# EAGLE design IndoorStation_PCB_M3 (EAGLE 9.7.0)
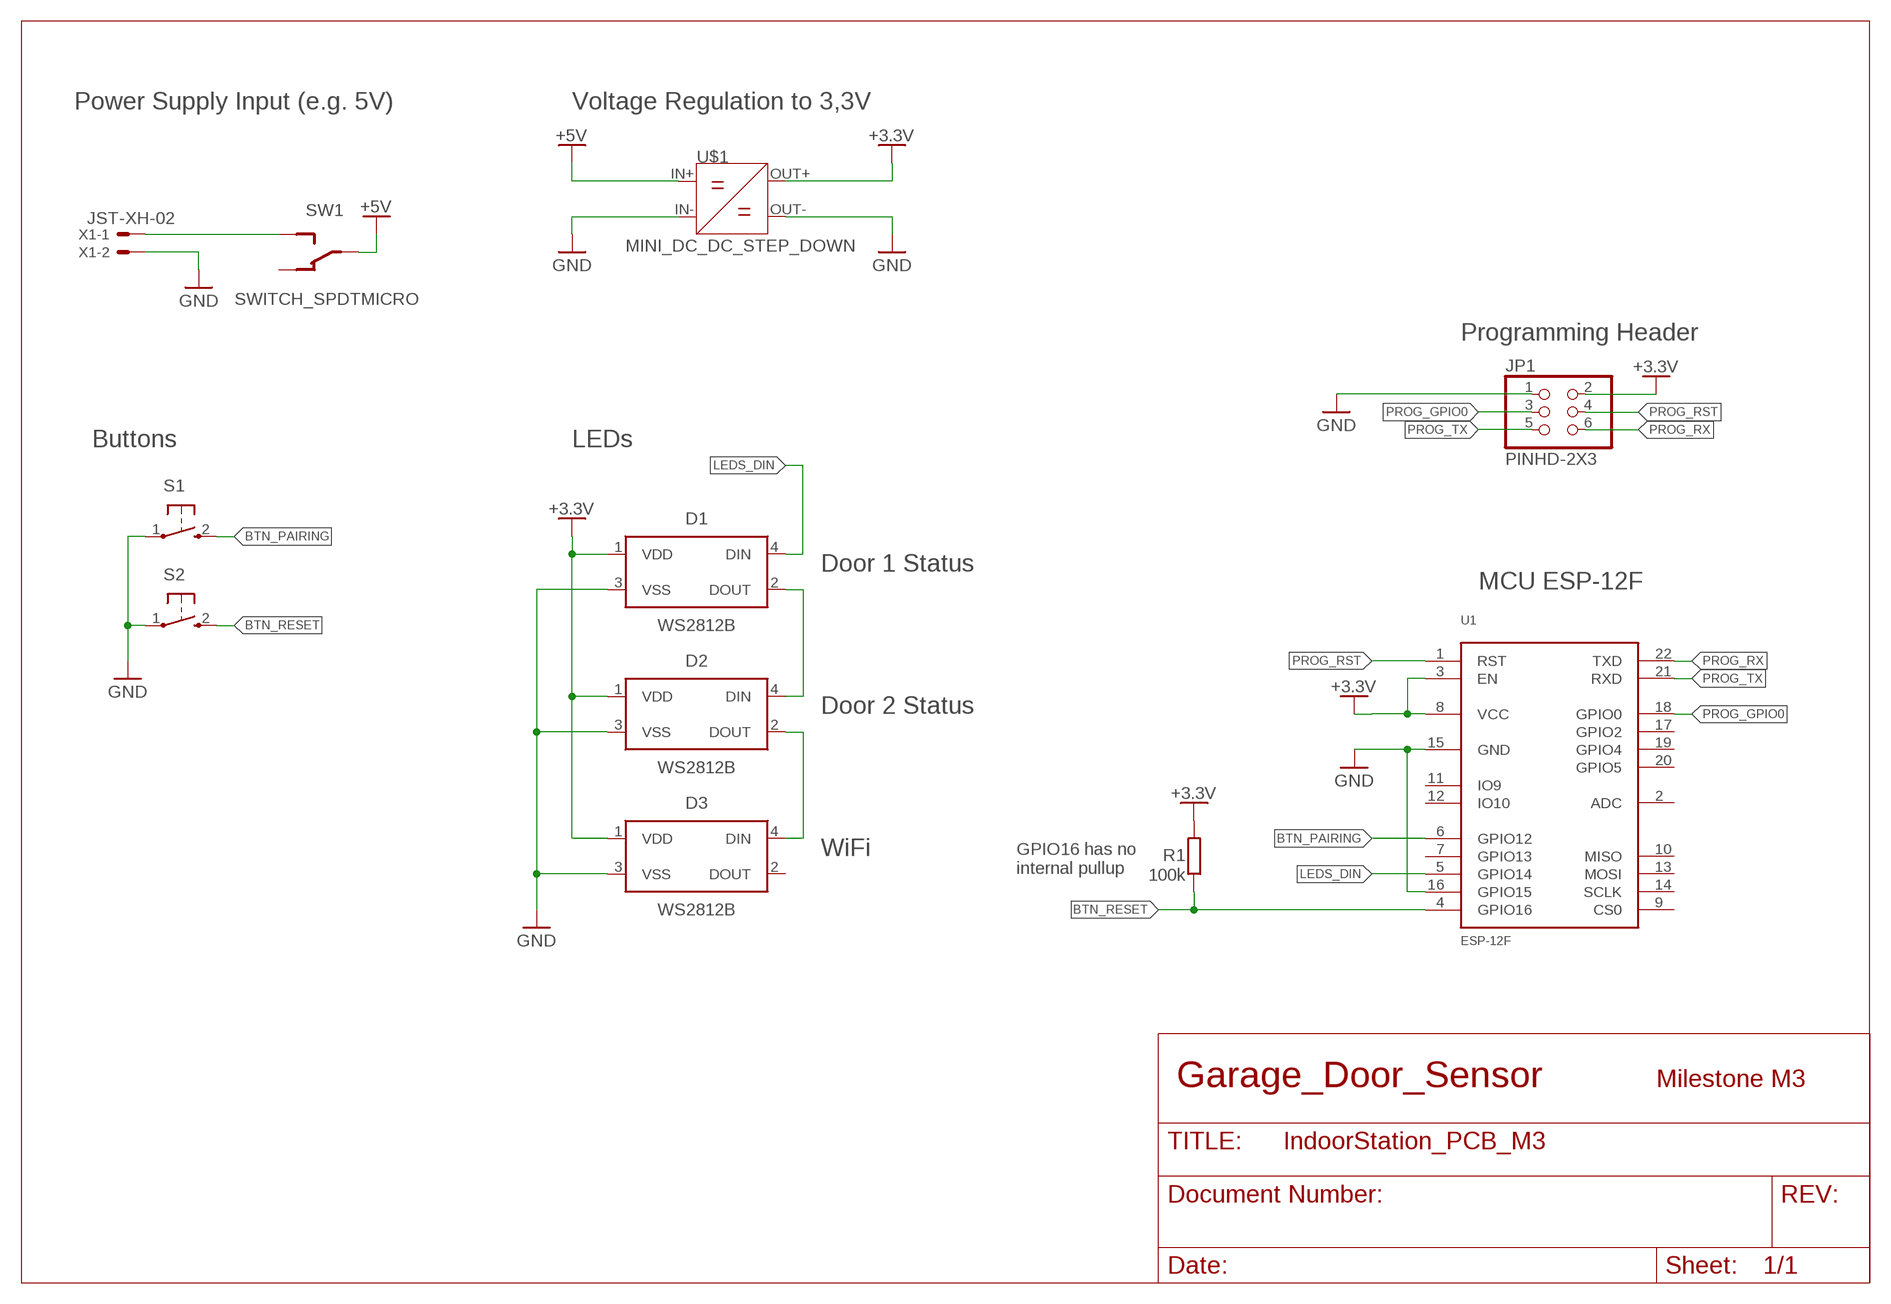
[diagram p0: schematic, sheet 1]

## Parts
D1  WS2812B  [WS2812B]
D2  WS2812B  [WS2812B]
D3  WS2812B  [WS2812B]
JP1  PINHD-2X3  [2X03]
R1  100k  R-EU_R0805  [R0805]
S1  KURZHUBTASTER  [B3F-10XX]
S2  KURZHUBTASTER  [B3F-10XX]
SW1  SWITCH_SPDTMICRO  [MICROSWITCH_SPDT]
U1  ESP-12F  [ESP-12F]
U$1  MINI_DC_DC_STEP_DOWN  [MINI_DC_DC_STEP_DOWN]
X1  JST-XH-02  JST-XH-02-PIN-EDGE  [JST-XH-02-EDGE]

## Nets
+3.3V: D1.1(VDD) D2.1(VDD) D3.1(VDD) JP1.2 R1.2 U1.3(EN) U1.8(VCC) U$1.OUT+
+5V: SW1.P$2 U$1.IN+
BTN_PAIRING: S1.2(S) U1.6(GPIO12)
BTN_RESET: R1.1 S2.2(S) U1.4(GPIO16)
GND: D1.3(VSS) D2.3(VSS) D3.3(VSS) JP1.1 S1.1(P) S2.1(P) U1.15(GND) U1.16(GPIO15) U$1.IN- U$1.OUT- X1.P$2
LEDS_DIN: D1.4(DIN) U1.5(GPIO14)
N$1: D1.2(DOUT) D2.4(DIN)
N$2: D2.2(DOUT) D3.4(DIN)
N$3: SW1.P$1 X1.P$1
PROG_GPIO0: JP1.3 U1.18(GPIO0)
PROG_RST: JP1.4 U1.1(RST)
PROG_RX: JP1.6 U1.22(TXD)
PROG_TX: JP1.5 U1.21(RXD)
Unconnected: D3.2(DOUT) SW1.P$3 U1.2(ADC) U1.7(GPIO13) U1.9(CS0) U1.10(MISO) U1.11(IO9) U1.12(IO10) U1.13(MOSI) U1.14(SCLK) U1.17(GPIO2) U1.19(GPIO4) U1.20(GPIO5)

## Notes on the sheet
- Power Supply Input (e.g. 5V) | Voltage Regulation to 3,3V
- Programming Header
- Buttons | LEDs
- Door 1 Status
- MCU ESP-12F
- Door 2 Status
- WiFi
- GPIO16 has no
  internal pullup
- Garage_Door_Sensor | Milestone M3

## Library data of the parts
D1-D3 = LED:WS2812B: Intelligent control LED integrated light source Datasheet <http://cdn.sparkfun.com/datasheets/BreakoutBoards/WS2812B.pdf>; CATEGORY: LED; COLOR: RGB; DESCRIPTION: LED integrated light source; MANUFACTURER: Worldsemi; MPN: WS2812B; OPERATING_TEMP: -25 ℃ to +80℃(TJ); PART_STATUS: Active; SUB_CATEGORY: RGB
JP1 = Connector:PINHD-2X3: PIN HEADER; CATEGORY: Headers; DESCRIPTION: Header, Straight, 2x3 Position; MANUFACTURER: Generic; MPN: Generic; OPERATING_TEMPERATURE: Generic; PART_STATUS: Active; PITCH: 0.100" (2.54mm); ROHS_COMPLIANCE: Generic; SERIES: Generic; SUB-CATEGORY: Headers, Male Pins; TYPE: Board to Board or Cable, Unshrouded, Through Hole, Straight
R1 = OwnDevices:R-EU_: RESISTOR, European symbol; SPICEPREFIX: R
S1 S2 = OwnDevices:KURZHUBTASTER: OMRON SWITCH
SW1 = OwnDevices:SWITCH_SPDT: https://www.roboter-bausatz.de/p/kippschalter-spdt-3a-250v-mts-102-ein-ein?number=RBS15499 Kleiner Kippschalter für DIY-Elektronik, RC-Modellbau oder Auto. Durch die Schalterstellungen Ein-Ein (Wechselschalter) können mit diesem Kippschalter zwei Stromkreise geschaltet werden. In jeder Position wird ein Stromkreis geöffnet und der andere gleichzeitig geschlossen. Der Schalter benötigt zum Einbau eine Frontplatte oder eine 6mm Bohrung. Details Schaltleistung: 3A/250V Kontaktwiderstand: < 20 mOhm Isolationswiderstand: > 1000 MOhm Durchschlagfestigkeit: 1500V~ (1 min.) Betriebstemperatur: -25~+85°C Schaltzyklen: 10.000 MTS-102 Schaltzustand: EIN - EIN Typ: SPDT Pins: 3
U1 = OwnDevices:ESP-12F: 317060163 Check availability <https://pricing.snapeda.com/parts/ESP-12F/AI-Thinker/view-part?ref=eda>; AVAILABILITY: Not in stock; CHECK_PRICES: https://www.snapeda.com/parts/ESP-12F/AI-Thinker/view-part/?ref=eda; DESCRIPTION: WiFi Module; MF: AI-Thinker; MP: ESP-12F; PACKAGE: Package; PRICE: None; SNAPEDA_LINK: https://www.snapeda.com/parts/ESP-12F/AI-Thinker/view-part/?ref=snap
U$1 = OwnDevices:MINI_DC_DC_STEP_DOWN: This is a Mini DC DC Step Down converter device. It was bought from https://www.ebay.de/itm/134446130259 Technical Parameters: Modular nature: non-isolated step-down Rectification: Synchronous rectification Input voltage: 4.75V-23V Output voltage: 1.0V-17V Output current: peak 3A, long time 1.8A Conversion efficiency: 96% (highest) Switching frequency: 340KHz Output ripple: 30mV (no load) Load regulation: ± 0.5% Voltage regulation: ± 2.5% Operating temperature: -40 ℃ to +85 ℃ Peripheral dimensions: 17 * 11 * 3.8 (L * W * H) (mm) Features: The use of one-piece forming power inductors and synchronous rectification control chip, smaller, more efficient.
X1 = OwnDevices:JST-XH-02-PIN: JST XH Connector 2 Pin Wire to board connector. Pitch: 2,54 mm, (0.100") Number of pins: 2 Created by Rembrandt Electronics www.rembrandtelectronics.com

## Board
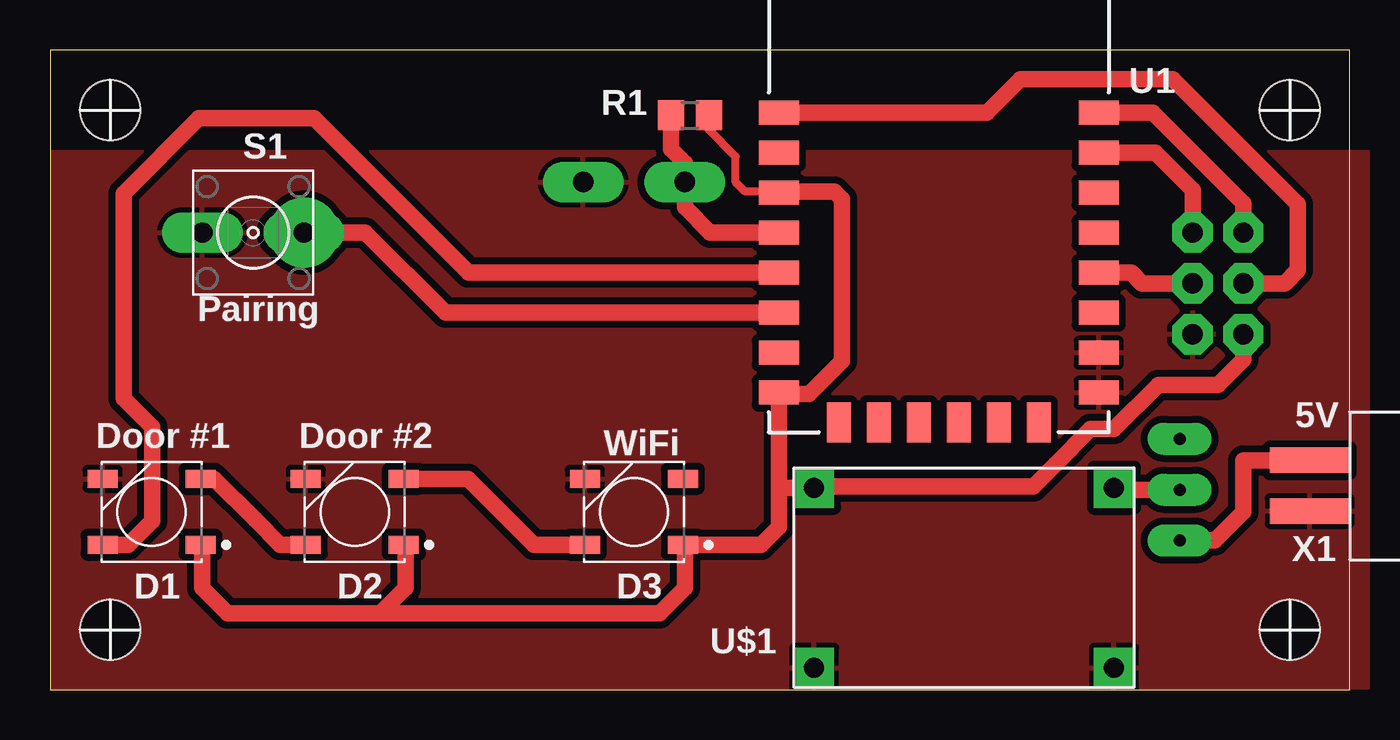
[diagram p1: board, top side]
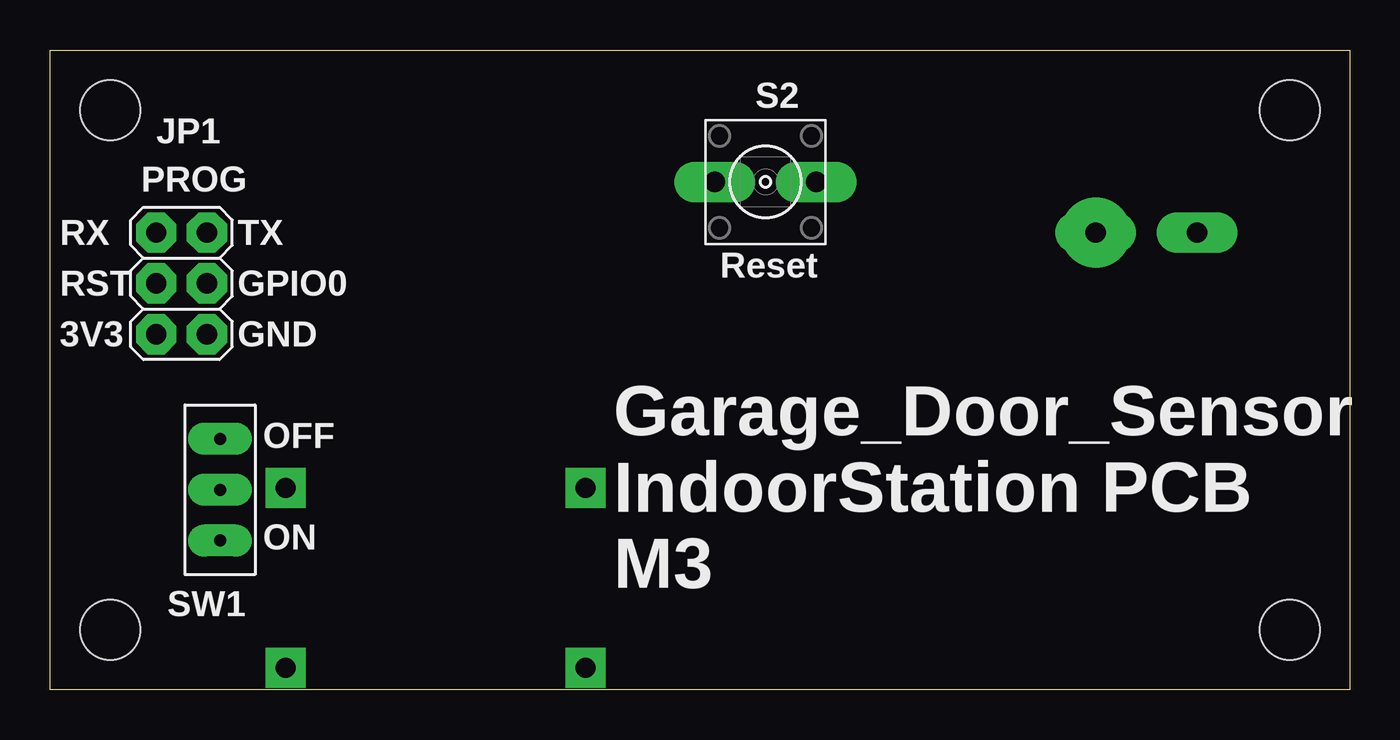
[diagram p2: board, bottom side, seen from below]

Size 65 x 32 mm. Coordinates in mm from the lower left corner, seen from the top.
Outline: 0,0 65,0 65,32 0,32 0,0
Copper layers (1*16): Top 0.035mm / dielectric 1.5mm / Bottom 0.035mm
Design rules "ownDesignRules2": minimum track width 0.4mm, minimum drill 0.5mm, track to track 0.35mm, track to pad 0.25mm, pad to pad 6mil, via to via 6mil, smd to smd 6mil, copper to edge 0mil, drill to drill 6mil, minimum pad ring 0.5mm, minimum via ring 8mil, stop-mask expansion 4mil, vias tented up to drill 0mil, thermal gap 10mil
Holes 3 mm at 62,29 62,3 3,3 3,29

### Footprints (pad centres in the part's own frame; a part is rotated, then mirrored left to right if it is on the bottom)
WS2812B = smd 1.5 x 0.9: 1 -2.45,1.65; 2 -2.45,-1.65; 3 2.45,-1.65; 4 2.45,1.65
2X03 = drill 1.016 octagon: 1 -2.54,-1.27; 2 -2.54,1.27; 3 0,-1.27; 4 0,1.27; 5 2.54,-1.27; 6 2.54,1.27
R0805 = smd 1.3 x 1.5: 1 -0.95,0; 2 0.95,0
B3F-10XX = drill 1.016 long: 1 -2.54,0; 2 2.54,0
MICROSWITCH_SPDT = drill 0.6 long: P$1 -2.54,0; P$2 0,0; P$3 2.54,0
ESP-12F = smd 2 x 1.2: 1 -8,3.48; 2 -8,1.48; 3 -8,-0.52; 4 -8,-2.52; 5 -8,-4.52; 6 -8,-6.52; 7 -8,-8.52; 8 -8,-10.52; 15 8,-10.52; 16 8,-8.52; 17 8,-6.52; 18 8,-4.52; 19 8,-2.52; 20 8,-0.52; 21 8,1.48; 22 8,3.48 | smd 1.2 x 2: 9 -5,-12; 10 -3,-12; 11 -1,-12; 12 1,-12; 13 3,-12; 14 5,-12
MINI_DC_DC_STEP_DOWN = drill 1 pad 2 square: IN+ 7.5,4.5; IN- 7.5,-4.5; OUT+ -7.5,4.5; OUT- -7.5,-4.5
JST-XH-02-EDGE = smd 1.27 x 4: P$1 -1.27,0; P$2 1.27,0

### Placement (x,y rotation side)
D1  5.08,8.89 180 top
D2  15.24,8.89 180 top
D3  29.21,8.89 180 top
JP1  58.42,20.32 90 bottom
R1  32,28.73 0 top
S1  10.16,22.86 0 top
S2  29.21,25.4 180 bottom
SW1  56.5,10 90 bottom
U1  44.45,25.37 0 top
U$1  45.72,5.6 0 top
X1  63,10.2 270 top

### Tracks (layer width: path | path; a pad name or v marks a point on that pad's centre or on a via)
+3.3V
  Top 0.4: D1.1 7.62,7.15 | D3.1 31.75,7.15 | 36.46,14.79 U1.8 36.46,14.79
  Top 0.406: R1.2 32.95,28.01 34.29,26.67 34.29,25.4 34.77,24.92 36.46,24.92
  Top 0.813: 36.46,14.79 37.96,14.79 39.6,16.44 39.6,24.55 39.23,24.92 36.46,24.92 U1.3 | 7.62,7.15 7.62,5.08 8.89,3.81 13.97,3.81 15.24,3.81 16.51,3.81 | 16.51,3.81 17.78,5.08 17.78,7.15 D2.1 | 31.75,7.15 31.75,5.08 30.48,3.81 16.51,3.81 | JP1.2 59.69,16.51 58.42,15.24 55.43,15.24 53.22,13.03 52.05,13.03 50.29,11.27 49.18,10.16 48.26,10.16 38.28,10.16 U$1.OUT+ 36.51,10.1 36.45,10.16 | D3.1 35.56,7.24 36.45,8.13 36.45,10.16 | U1.8 36.45,10.16
+5V
  Top 0.813: SW1.P$2 53.32,10 U$1.IN+
BTN_PAIRING  (via drill 0.5 pad 3.5)
  Top 0.813: S1.2 15.77,22.86 19.78,18.85 U1.6
  other vias: 12.7,22.86
BTN_RESET
  Top 0.813: U1.4 33.03,22.85 33.02,22.86 31.75,24.13 S2.2 31.75,26.34 31.05,27.04 R1.1
GND
  pour Top: 0.08,0.08 65.96,0.08 65.96,26.92 0.08,26.92
  pour Top: 29.41,25.6 35.36,25.6 35.36,30.28 29.41,30.28
LEDS_DIN
  Top 0.813: U1.5 20.93,20.85 13.2,28.59 7.44,28.59 3.68,24.82 3.68,14.55 5.1,13.13 5.1,8.44 3.9,7.24 D1.4
N$1
  Top 0.813: D1.2 8.22,10.54 10.25,8.51 11.52,7.24 D2.4
N$2
  Top 0.813: D3.4 24.22,7.24 20.92,10.54 D2.2
N$3
  Top 0.813: SW1.P$1 58.26,7.46 58.42,7.62 59.69,8.89 59.69,11.47 X1.P$1
PROG_GPIO0
  Top 0.813: U1.18 54.08,20.85 54.61,20.32 JP1.3
PROG_RST
  Top 0.813: U1.1 46.85,28.85 48.55,30.55 56.16,30.55 62.42,24.29 62.42,20.99 61.75,20.32 JP1.4
PROG_RX
  Top 0.813: U1.22 55.17,28.85 59.69,24.34 JP1.6
PROG_TX
  Top 0.813: U1.21 55.3,26.85 57.15,25 JP1.5

### Text on the board
tNames: Pairing | 5V | Door #1 | Door #2 | WiFi
bNames: PROG | TX | RX | Reset | GPIO0 | RST | GND | 3V3 | OFF | ON | Garage_Door_Sensor / IndoorStation PCB / M3